# Altium project MCU036A_MSP-EXP430FR2355.PrjPcb (part 1 of 3)
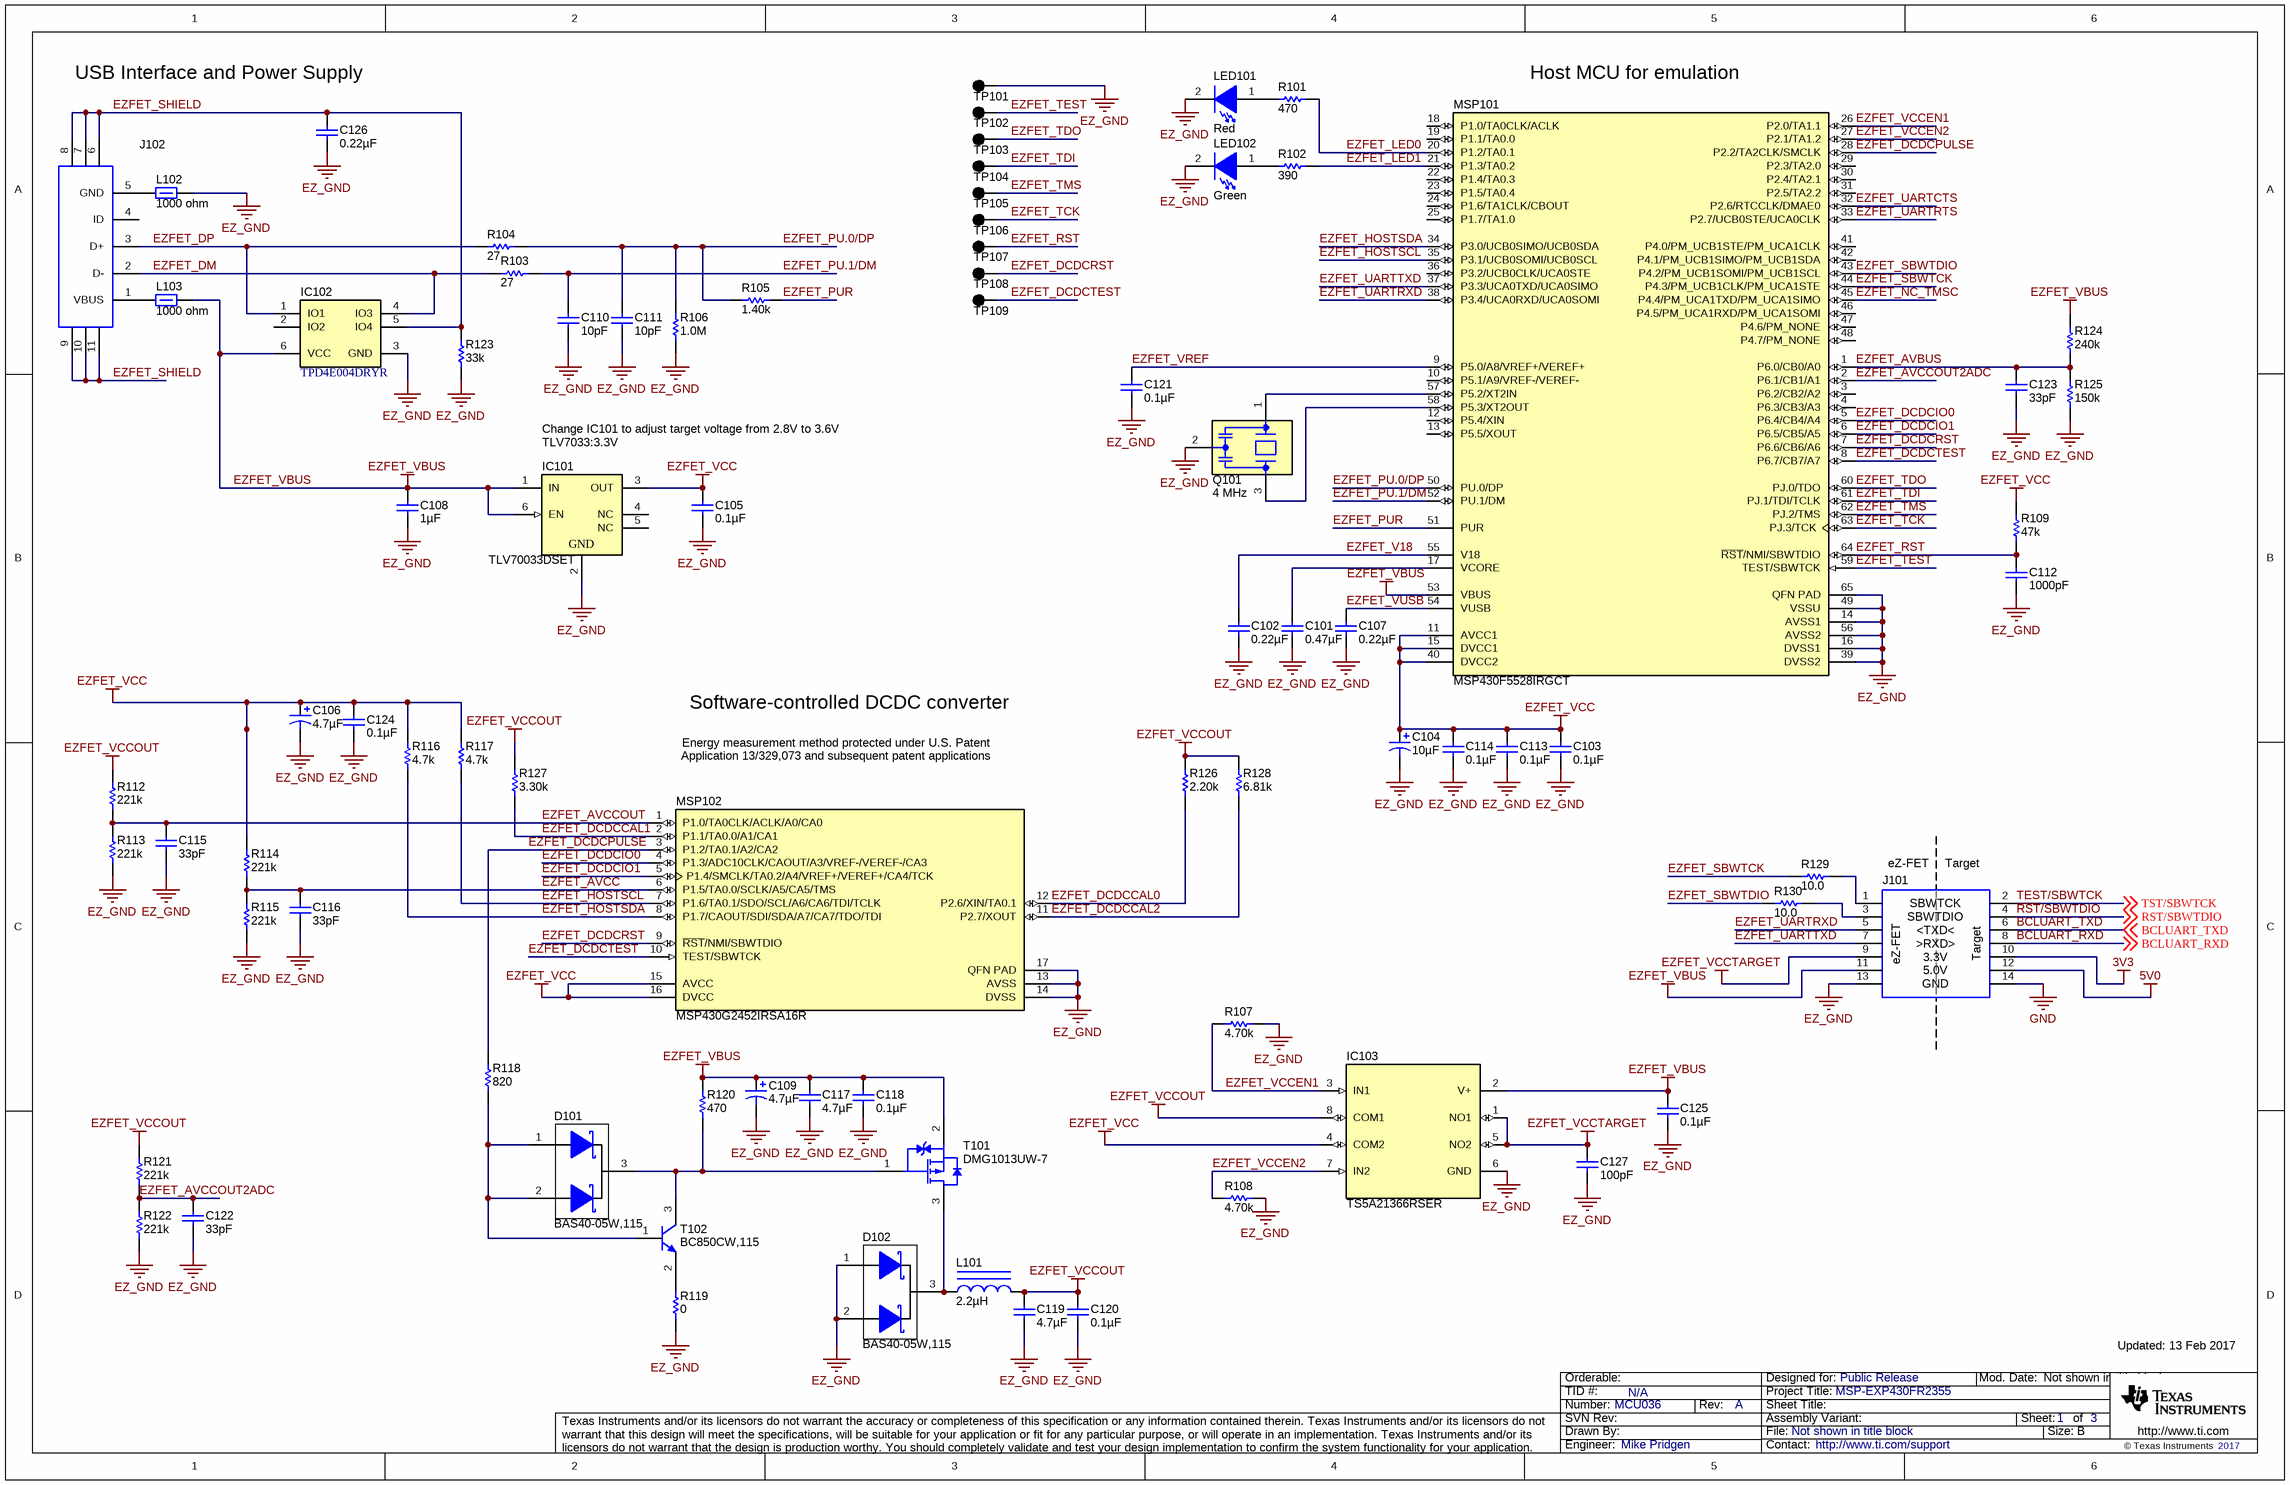
[diagram p0: MCU036A_eZFET_1.4.SchDoc]
CopyrightYear: 2017; PCB_Layout: Mike Pridgen; PCB_Rev: A; PRJ_Customer: Public Release; PRJ_Engineer: Mike Pridgen; PRJ_Number: MCU036; PRJ_Title: MSP-EXP430FR2355; SCH_Rev: A; TechSupport: http://www.ti.com/support; TID: N/A
3 sheets, 142 parts. Net scope: global (net labels, ports and power ports of the same name join across sheets).
Board file: MCU036A_MSP-EXP430FR2355_PCB.PcbDoc
Sheets:
  MCU036A_eZFET_1.4.SchDoc
  MCU036A_Target_Device.SchDoc
  MCU036A_Hardware.SchDoc

## Sheet MCU036A_eZFET_1.4.SchDoc
size 431 x 279 mm; Date: Not shown in title block; ApprovedBy: Not shown in title block; CheckedBy: Not shown in title block; Author: Not shown in title block; CompanyName: Not shown in title block; Engineer: Not shown in title block; Organization: Not shown in title block; Address1: Not shown in title block; Address2: Not shown in title block; Address3: Not shown in title block; Address4: Not shown in title block; DocumentNumber: 1; Revision: Use project parameter SCH_Rev; SheetNumber: 1; SheetTotal: 3; PageSetup: Record=PageOptions|CenterHorizontal=True|CenterVertical=True|PrintScale=1.00|XCorrection=1.00|YCorrection=1.00|PrintKind=0|BorderSize=5000000|LeftOffset=0|BottomOffset=0|Orientation=2|PaperLength=1000|PaperWidth=1000|Scale=100|PaperSource=15|PrintQuality=600|MediaType=1|DitherType=10|PaperKind=Letter|PrintScaleMode=1; CurrentTime: Not shown in title block; CurrentDate: Not shown in title block; Time: Not shown in title block; DocumentFullPathAndName: Not shown in title block; DocumentName: Not shown in title block; ModifiedDate: Not shown in title block; ImagePath: Not shown in title block

### Parts
C101  ValueDisplayed: 0.47µF  [0402]  (hidden comment: GRM155R61C474KE01)
C102  ValueDisplayed: 0.22µF  [0603]  (hidden comment: GRM188R61C224KA88D)
C103  ValueDisplayed: 0.1µF  [0402]  (hidden comment: GRM155R61A104KA01D)
C104  ValueDisplayed: 10µF  [3216-18]  (hidden comment: 293D106X0010A2TE3)
C105  ValueDisplayed: 0.1µF  [0402]  (hidden comment: GRM155R61A104KA01D)
C106  ValueDisplayed: 4.7µF  [3216-18]  (hidden comment: 293D475X9010A2TE3)
C107  ValueDisplayed: 0.22µF  [0603]  (hidden comment: GRM188R61C224KA88D)
C108  ValueDisplayed: 1µF  [0603]  (hidden comment: GRM185R61A105KE36D)
C109  ValueDisplayed: 4.7µF  [3216-18]  (hidden comment: 293D475X9010A2TE3)
C110  ValueDisplayed: 10pF  [0402]  (hidden comment: GRM1555C1H100JA01D)
C111  ValueDisplayed: 10pF  [0402]  (hidden comment: GRM1555C1H100JA01D)
C112  ValueDisplayed: 1000pF  [0402]  (hidden comment: GRM155R71H102KA01D)
C113  ValueDisplayed: 0.1µF  [0402]  (hidden comment: GRM155R61A104KA01D)
C114  ValueDisplayed: 0.1µF  [0402]  (hidden comment: GRM155R61A104KA01D)
C115  ValueDisplayed: 33pF  [0402]  (hidden comment: GRM1555C1H330JA01D)
C116  ValueDisplayed: 33pF  [0402]  (hidden comment: GRM1555C1H330JA01D)
C117  ValueDisplayed: 4.7µF  [0603]  (hidden comment: GRM188R61C475KAAJ)
C118  ValueDisplayed: 0.1µF  [0402]  (hidden comment: GRM155R61A104KA01D)
C119  ValueDisplayed: 4.7µF  [0603]  (hidden comment: GRM188R61C475KAAJ)
C120  ValueDisplayed: 0.1µF  [0402]  (hidden comment: GRM155R61A104KA01D)
C121  ValueDisplayed: 0.1µF  [0402]  (hidden comment: GRM155R61A104KA01D)
C122  ValueDisplayed: 33pF  [0402]  (hidden comment: GRM1555C1H330JA01D)
C123  ValueDisplayed: 33pF  [0402]  (hidden comment: GRM1555C1H330JA01D)
C124  ValueDisplayed: 0.1µF  [0402]  (hidden comment: GRM155R61A104KA01D)
C125  ValueDisplayed: 0.1µF  [0402]  (hidden comment: GRM155R61A104KA01D)
C126  ValueDisplayed: 0.22µF  [0402]  (hidden comment: GRM155R61A224KE19D)
C127  ValueDisplayed: 100pF  [0402]  (hidden comment: GRM1555C1H101JA01D)
D101  BAS40-05W,115  [SOT-323]
D102  BAS40-05W,115  [SOT-323]
IC101  TLV70033DSET  [DSE0006A]
IC102  TPD4E004DRYR  [DRY0006A]
IC103  TS5A21366RSER  [RSE0008A]
J101  PEC07DAAN  [PEC07DAAN_Launchpad_EZ-FET]  (value not drawn)
J102  1051640001  [Molex_1051640001]  (value not drawn)
L101  ValueDisplayed: 2.2µH  [CBC2518]  (hidden comment: CBC2518T2R2M)
L102  ValueDisplayed: 1000 ohm  [0603]  (hidden comment: BLM18HE102SN1D)
L103  ValueDisplayed: 1000 ohm  [0603]  (hidden comment: BLM18HE102SN1D)
LED101  value Red  [LED_LTST-C190_Red]  (hidden comment: LTST-C190CKT)
LED102  value Green  [LED_LTST-C190]  (hidden comment: LTST-C190GKT)
MSP101  MSP430F5528IRGCT  [RGC0064B]
MSP102  MSP430G2452IRSA16R  [RSA0016B]
Q101  Frequency: 4 MHz  [Murata_CSTCR]  (hidden comment: CSTCR4M00G15L99-R0)
R101  ValueDisplayed: 470  [0402]  (hidden comment: CRCW0402470RJNED)
R102  ValueDisplayed: 390  [0402]  (hidden comment: CRCW0402390RJNED)
R103  ValueDisplayed: 27  [0402]  (hidden comment: CRCW040227R0JNED)
R104  ValueDisplayed: 27  [0402]  (hidden comment: CRCW040227R0JNED)
R105  ValueDisplayed: 1.40k  [0402]  (hidden comment: CRCW04021K40FKED)
R106  ValueDisplayed: 1.0M  [0402]  (hidden comment: CRCW04021M00JNED)
R107  ValueDisplayed: 4.70k  [0402]  (hidden comment: CRG0402F4K7)
R108  ValueDisplayed: 4.70k  [0402]  (hidden comment: CRG0402F4K7)
R109  ValueDisplayed: 47k  [0402]  (hidden comment: CRCW040247K0JNED)
R112  ValueDisplayed: 221k  [0402]  (hidden comment: CRCW0402221KFKED)
R113  ValueDisplayed: 221k  [0402]  (hidden comment: CRCW0402221KFKED)
R114  ValueDisplayed: 221k  [0402]  (hidden comment: CRCW0402221KFKED)
R115  ValueDisplayed: 221k  [0402]  (hidden comment: CRCW0402221KFKED)
R116  ValueDisplayed: 4.7k  [0402]  (hidden comment: CRCW04024K70JNED)
R117  ValueDisplayed: 4.7k  [0402]  (hidden comment: CRCW04024K70JNED)
R118  ValueDisplayed: 820  [0402]  (hidden comment: RC0402FR-07820RL)
R119  ValueDisplayed: 0  [0402]  (hidden comment: CRCW04020000Z0ED)
R120  ValueDisplayed: 470  [0402]  (hidden comment: CRCW0402470RJNED)
R121  ValueDisplayed: 221k  [0402]  (hidden comment: CRCW0402221KFKED)
R122  ValueDisplayed: 221k  [0402]  (hidden comment: CRCW0402221KFKED)
R123  ValueDisplayed: 33k  [0402]  (hidden comment: CRCW040233K0JNED)
R124  ValueDisplayed: 240k  [0402]  (hidden comment: CRCW0402240KFKED)
R125  ValueDisplayed: 150k  [0402]  (hidden comment: CRCW0402150KFKED)
R126  ValueDisplayed: 2.20k  [0402]  (hidden comment: CRCW04022K20FKED)
R127  ValueDisplayed: 3.30k  [0402]  (hidden comment: ERJ-2RKF3301X)
R128  ValueDisplayed: 6.81k  [0402]  (hidden comment: CRCW04026K81FKED)
R129  ValueDisplayed: 10.0  [0402]  (hidden comment: CRCW040210R0FKED)
R130  ValueDisplayed: 10.0  [0402]  (hidden comment: CRCW040210R0FKED)
T101  DMG1013UW-7  [SOT-323]
T102  BC850CW,115  [SOT-323]
TP101  5001  [Keystone5001]  (value not drawn)
TP102  5001  [Keystone5001]  (value not drawn)
TP103  5001  [Keystone5001]  (value not drawn)
TP104  5001  [Keystone5001]  (value not drawn)
TP105  5001  [Keystone5001]  (value not drawn)
TP106  5001  [Keystone5001]  (value not drawn)
TP107  5001  [Keystone5001]  (value not drawn)
TP108  5001  [Keystone5001]  (value not drawn)
TP109  5001  [Keystone5001]  (value not drawn)

### Nets
3V3: J101.10
5V0: J101.12
EZ_GND: C101.1 C102.1 C103.1 C104.2(-) C105.1 C106.2(-) C107.1 C108.1 C109.2(-) C110.2 C111.2 C112.1 C113.1 C114.1 C115.1 C116.1 C117.1 C118.1 C119.1 C120.1 C121.1 C122.1 C123.1 C124.1 C125.1 C126.1 C127.2 D102.1(A) D102.2(A) IC101.2(GND) IC102.3(GND) IC103.6(GND) J101.13 L102.2 LED101.2(K) LED102.2(K) MSP101.14(AVSS1) MSP101.16(DVSS1) MSP101.39(DVSS2) MSP101.49(VSSU) MSP101.56(AVSS2) MSP101.65(QFN_PAD) MSP102.13(AVSS) MSP102.14(DVSS) MSP102.17(QFN_PAD) Q101.2(GND) R106.1 R107.1 R108.1 R113.2 R115.2 R119.1 R122.2 R123.1 R125.2 TP101.1
EZFET_VBUS: C108.2 C109.1(+) C117.2 C118.2 C125.2 IC101.1(IN) IC101.6(EN) IC102.6(VCC) IC103.2(V+) J101.11 L103.2 MSP101.53(VBUS) R120.2 R124.1 T101.2(S)
EZFET_VCC: C103.2 C104.1(+) C105.2 C106.1(+) C113.2 C114.2 C124.2 IC101.3(OUT) IC103.4(COM2) MSP101.11(AVCC1) MSP101.15(DVCC1) MSP101.40(DVCC2) MSP102.15(AVCC) MSP102.16(DVCC) R109.1 R114.1 R116.1 R117.1
EZFET_VCCOUT: C119.2 C120.2 IC103.8(COM1) L101.2 R112.1 R121.1 R126.2 R127.2 R128.1
EZFET_VCCTARGET: C127.1 IC103.1(NO1) IC103.5(NO2) J101.9
GND: J101.14
BCLUART_RXD: J101.8 ; off-sheet BCLUART_RXD  [project net BCL_RXD]
BCLUART_TXD: J101.6 ; off-sheet BCLUART_TXD  [project net BCL_TXD]
EZFET_AVBUS: C123.2 MSP101.1(P6.0/CB0/A0) R124.2 R125.1
EZFET_AVCC: C116.2 MSP102.6(P1.5/TA0.0/SCLK/A5/CA5/TMS) R114.2 R115.1
EZFET_AVCCOUT: C115.2 MSP102.1(P1.0/TA0CLK/ACLK/A0/CA0) R112.2 R113.1
EZFET_AVCCOUT2ADC: C122.2 MSP101.2(P6.1/CB1/A1) R121.2 R122.1
EZFET_DCDCCAL0: MSP102.12(P2.6/XIN/TA0.1) R126.1
EZFET_DCDCCAL1: MSP102.2(P1.1/TA0.0/A1/CA1) R127.1
EZFET_DCDCCAL2: MSP102.11(P2.7/XOUT) R128.2
EZFET_DCDCIO0: MSP101.5(P6.4/CB4/A4) MSP102.4(P1.3/ADC10CLK/CAOUT/A3/VREF-/VEREF-/CA3)
EZFET_DCDCIO1: MSP101.6(P6.5/CB5/A5) MSP102.5(P1.4/SMCLK/TA0.2/A4/VREF+/VEREF+/CA4/TCK)
EZFET_DCDCPULSE: MSP101.28(P2.2/TA2CLK/SMCLK) MSP102.3(P1.2/TA0.1/A2/CA2) R118.2
EZFET_DCDCRST: MSP101.7(P6.6/CB6/A6) MSP102.9(~{RST}/NMI/SBWTDIO) TP108.1
EZFET_DCDCTEST: MSP101.8(P6.7/CB7/A7) MSP102.10(TEST/SBWTCK) TP109.1
EZFET_DM: IC102.4(IO3) J102.2(D-) R103.1
EZFET_DP: IC102.1(IO1) J102.3(D+) R104.1
EZFET_HOSTSCL: MSP101.35(P3.1/UCB0SOMI/UCB0SCL) MSP102.7(P1.6/TA0.1/SDO/SCL/A6/CA6/TDI/TCLK) R117.2
EZFET_HOSTSDA: MSP101.34(P3.0/UCB0SIMO/UCB0SDA) MSP102.8(P1.7/CAOUT/SDI/SDA/A7/CA7/TDO/TDI) R116.2
EZFET_LED0: MSP101.20(P1.2/TA0.1) R101.2
EZFET_LED1: MSP101.21(P1.3/TA0.2) R102.2
EZFET_NC_TMSC: MSP101.45(P4.4/PM_UCA1TXD/PM_UCA1SIMO)
EZFET_PU.0/DP: C111.1 MSP101.50(PU.0/DP) R104.2 R105.2 R106.2
EZFET_PU.1/DM: C110.1 MSP101.52(PU.1/DM) R103.2
EZFET_PUR: MSP101.51(PUR) R105.1
EZFET_RST: C112.2 MSP101.64(~{RST}/NMI/SBWTDIO) R109.2 TP107.1
EZFET_SBWTCK: MSP101.44(P4.3/PM_UCB1CLK/PM_UCA1STE) R129.1
EZFET_SBWTDIO: MSP101.43(P4.2/PM_UCB1SOMI/PM_UCB1SCL) R130.1
EZFET_SHIELD: C126.2 IC102.5(IO4) J102.6 J102.7 J102.8 J102.9 J102.10 J102.11 R123.2
EZFET_TCK: MSP101.63(PJ.3/TCK) TP106.1
EZFET_TDI: MSP101.61(PJ.1/TDI/TCLK) TP104.1
EZFET_TDO: MSP101.60(PJ.0/TDO) TP103.1
EZFET_TEST: MSP101.59(TEST/SBWTCK) TP102.1
EZFET_TMS: MSP101.62(PJ.2/TMS) TP105.1
EZFET_UARTCTS: MSP101.32(P2.6/RTCCLK/DMAE0)
EZFET_UARTRTS: MSP101.33(P2.7/UCB0STE/UCA0CLK)
EZFET_UARTRXD: J101.5 MSP101.38(P3.4/UCA0RXD/UCA0SOMI)
EZFET_UARTTXD: J101.7 MSP101.37(P3.3/UCA0TXD/UCA0SIMO)
EZFET_V18: C102.2 MSP101.55(V18)
EZFET_VCCEN1: IC103.3(IN1) MSP101.26(P2.0/TA1.1) R107.2
EZFET_VCCEN2: IC103.7(IN2) MSP101.27(P2.1/TA1.2) R108.2
EZFET_VREF: C121.2 MSP101.9(P5.0/A8/VREF+/VEREF+)
EZFET_VUSB: C107.2 MSP101.54(VUSB)
~{RST}/SBWTDIO: J101.4 ; off-sheet RST/SBWTDIO  [also labelled RST/SBWTDIO]  [project net ~{RST}]
TEST/SBWTCK: J101.2 ; off-sheet TST/SBWTCK  [also labelled TST/SBWTCK]  [project net SBWTCK]
NetC101_2: C101.2 MSP101.17(VCORE)
NetD101_1: D101.1(A) D101.2(A) R118.1 T102.1(B)
NetD101_3: D101.3(K) R120.1 T101.1(G) T102.3(C)
NetD102_3: D102.3(K) L101.1 T101.3(D)
NetJ101_1: J101.1 R129.2
NetJ101_3: J101.3 R130.2
NetJ102_1: J102.1(VBUS) L103.1
NetJ102_5: J102.5(GND) L102.1
NetLED101_1: LED101.1(A) R101.1
NetLED102_1: LED102.1(A) R102.1
NetMSP101_57: MSP101.57(P5.2/XT2IN) Q101.1(In)
NetMSP101_58: MSP101.58(P5.3/XT2OUT) Q101.3(Out)
NetR119_2: R119.2 T102.2(E)

Not connected (* = marked no-connect by the designer): IC101 4(NC) 5(NC); IC102 2(IO2); J102 4(ID); MSP101 3(P6.2/CB2/A2) 4(P6.3/CB3/A3) 10(P5.1/A9/VREF-/VEREF-) 12(P5.4/XIN) 13(P5.5/XOUT) 18(P1.0/TA0CLK/ACLK) 19(P1.1/TA0.0) 22(P1.4/TA0.3) 23(P1.5/TA0.4) 24(P1.6/TA1CLK/CBOUT) 25(P1.7/TA1.0) 29(P2.3/TA2.0) 30(P2.4/TA2.1) 31(P2.5/TA2.2) 36(P3.2/UCB0CLK/UCA0STE) 41(P4.0/PM_UCB1STE/PM_UCA1CLK) 42(P4.1/PM_UCB1SIMO/PM_UCB1SDA) 46(P4.5/PM_UCA1RXD/PM_UCA1SOMI) 47(P4.6/PM_NONE) 48(P4.7/PM_NONE)

### Notes on the sheet
- (near C126) USB Interface and Power Supply
- (near MSP101) Host MCU for emulation
- Change IC101 to adjust target voltage from 2.8V to 3.6V
- (near IC101) TLV7033:3.3V
- Software-controlled DCDC converter
- Energy measurement method protected under U.S. Patent
- Application 13/329,073 and subsequent patent applications
- (near J101) eZ-FET
- (near J101) Target
- Updated: 13 Feb 2017
- Drawn By:
- SVN Rev:
- Number:
- TID #:
- Orderable:
- Rev:
- Sheet Title:
- File:
- Project Title:
- Designed for:
- Assembly Variant:
- Mod. Date:
- Sheet:
- Size:
- of
- B
- http://www.ti.com
- Texas Instruments and/or its licensors do not warrant the accuracy or completeness of this specification or any information contained therein. Texas Instruments and/or its licensors do not warrant that this design will meet the specifications, will be suitable for your application or fit for any particular purpose, or will operate in an implementation. Texas Instruments and/or its licensors do not warrant that the design is production worthy. You should completely validate and test your design implementation to confirm the system functionality for your application.
- Engineer:
- Contact:
- © Texas Instruments
- (in symbol PEC07DAAN) SBWTCK; SBWTDIO; <TXD<; eZ-FET; >RXD>; Target; 3.3V; 5.0V; GND